# Altium project BSPD_Sensorboard.PrjPcb
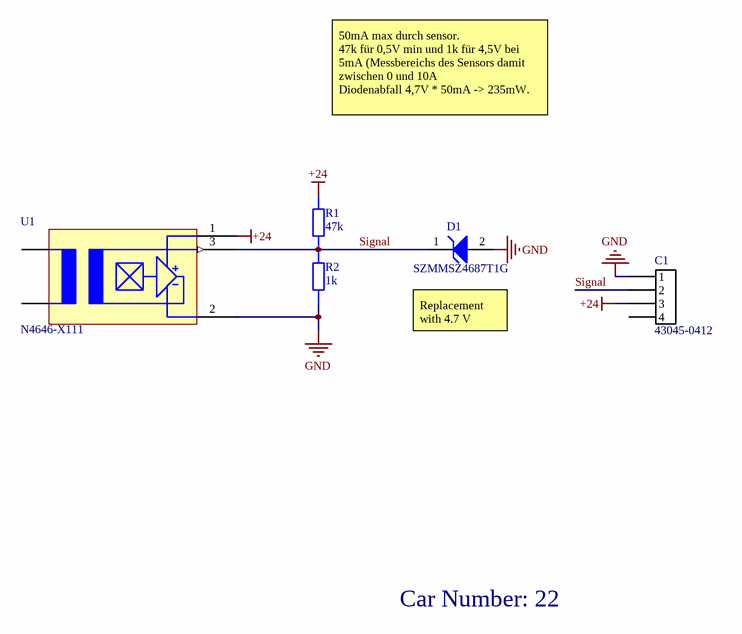
[diagram p0: SCH_BSPD_Sensorboard.SchDoc]
1 sheet, 5 parts. Net scope: global (net labels, ports and power ports of the same name join across sheets).
Board file: PCB_BSPD_Sensorboard.PcbDoc

## Sheet SCH_BSPD_Sensorboard.SchDoc: BSPD Sensorboard
size A4; CheckedBy: Nico Bieberich; Author: Lukas Deeken; Organization: Baltic Racing; Address1: Zur Schwedenschanze 15; Address2: 18435 Stralsund; Address3: Deutschland; DocumentNumber: 1; Revision: 1.0; SheetNumber: 1; SheetTotal: 1

### Parts
C1  43045-0412  [43045-0412]
D1  SZMMSZ4687T1G  [ONSC-SOD-123-2-425-04_V]
R1  value 47k  [STACKPOLE CSR0603]  (hidden comment: SMD Resistor)
R2  value 1k  [STACKPOLE CSR0603]  (hidden comment: SMD Resistor)
U1  N4646-X111  [N4646-X100]

### Nets
+24: C1.3 R1.2 U1.1(V_cc)
GND: C1.1 D1.2(A) R2.1 U1.2(-V_cc)
Signal: C1.2 D1.1(K) R1.1 R2.2 U1.3(I_s)

Not connected (* = marked no-connect by the designer): C1 4

### Notes on the sheet
- 50mA max durch sensor.
  47k für 0,5V min und 1k für 4,5V bei 5mA (Messbereichs des Sensors damit zwischen 0 und 10A
  Diodenabfall 4,7V * 50mA -> 235mW.
- (near D1) Replacement
  with 4.7 V
- Car Number: 22
- Title:
- Projekt:
- Revision:
- Author:
- Rules:
- Checked by:
- Sheet
- of
- Size:
- A4
- Date:
- Time:

### Library data of the parts
C1 = MicroFit3.0 4-Pin: Molex Micro-Fit 3.0 4-Pin / 600V / 8.5A
D1 = CMP-1060-00576-1: Zener Voltage Regulator, 500 mW, 2-Pin SOD-123, Pb-Free, Tape and Reel; Manufacturer: On Semiconductor; P Max (W): 0.5; VZ Typ (V): 4.3; Packing: Tape and Reel; PackageVersion: Rev. G, 10/2009; PackageDescription: 2-Pin SOD, Body 1.6 x 2.69 mm; PartNumber: SZMMSZ4687T1G; ComponentLink3URL: http://www.onsemi.com/pub_link/Collateral/425-04.PDF; Mounting Technology: Surface Mount; ComponentLink3Description: Package Specification; ComponentLink1Description: Manufacturer URL; RoHS: Pb-Free; PackageReference: SOD-123-2-425-04; ComponentLink1URL: http://www.onsemi.com/; ComponentLink2Description: Datasheet; DatasheetVersion: Rev. 9; ComponentLink2URL: http://www.onsemi.com/pub_link/Collateral/MMSZ4678T1-D.PDF
R1 R2 = SMD Resistor: Resistor with multiple footprints; Power: 0.1W
U1 = N4646-X100